# Altium schematic sheet RTC.SchDoc
size A4; SheetNumber: 6; SheetTotal: 6
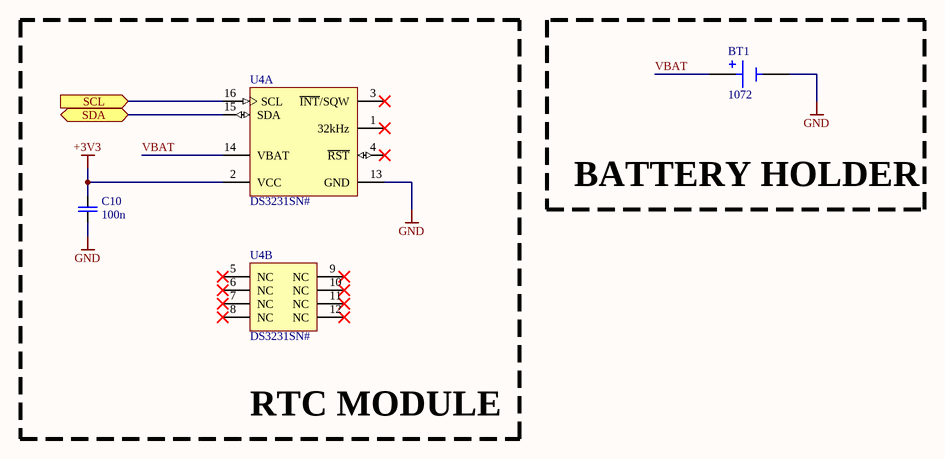
[diagram p0: RTC.SchDoc]

## Parts
BT1  1072  [BAT_1072]
C10  100n  [C0603]
U4  DS3231SN#  [W16#H2_L]  (parts A,B of 2)

## Blocks framed on the sheet
RTC MODULE: C10 U4
BATTERY HOLDER: BT1

## Ports
SCL (in, see MED_BOX[2B], I2C_GPIO_EXPANDER[1B], MCU[2B]), SDA (bidir, see MED_BOX[2B], I2C_GPIO_EXPANDER[1B], MCU[2B])

## Nets
+3V3: C10.2 U4.2(VCC)
GND: BT1.N(NEG) C10.1 U4.13(GND)
SCL: U4.16(SCL) ; port SCL
SDA: U4.15(SDA) ; port SDA
VBAT: BT1.P(POS) U4.14(VBAT)

Not connected (* = marked no-connect by the designer): U4 1(32kHz)* 3(~{INT}/SQW)* 4(~{RST})* 5(NC)* 6(NC)* 7(NC)* 8(NC)* 9(NC)* 10(NC)* 11(NC)* 12(NC)*

## Library data of the parts
BT1 = 1072: Battery Holder CR1220/1225; MF: Keystone Electronics; SnapEDA_Link: https://www.snapeda.com/parts/1072/Keystone/view-part/?ref=snap; Package: NON STANDARD-2 Keystone; Value: *; MP: 1072; Check_prices: https://www.snapeda.com/parts/1072/Keystone/view-part/?ref=eda
C10 = CMP-00024-8: Generic 0603 SMD Ceramic Capacitor
U4 = CMP-0254-00293-2: Extremely Accurate I2C-Integrated Real-Time Clock/TCXO/Crystal, 16-Pin SO, -40 to 85 degC, RoHS Qualified; Code_IPC: SOIC127P1030-16; ComponentLink2URL: http://datasheets.maxim-ic.com/en/ds/DS3231.pdf; Code_JEDEC: MS-013-AA; ComponentLink1URL: http://www.maxim-ic.com; ComponentLink2Description: Datasheet; ComponentLink3Description: Package Specification; DatasheetVersion: Rev 8, Jul-2010; PackageVersion: revD, 2010; ComponentLink1Description: Manufacturer URL; PackageDescription: 16-Pin Small-Outline IC, Wide (0.3in), 1.27 mm Pitch, SOIC (W), RoHS Qualified; ComponentLink3URL: http://pdfserv.maxim-ic.com/package_dwgs/21-0042.PDF; PackageReference: W16#H2